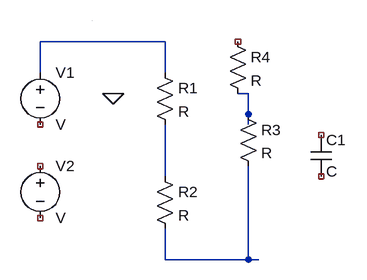
[diagram p0: schematic Draft1.asc]
Draft1.asc, the LTspice schematic file:
Version 4.1
SHEET 1 880 680
WIRE 112 32 -80 32
WIRE -80 80 -80 32
WIRE 112 80 112 32
WIRE 240 112 224 112
WIRE 240 144 240 112
WIRE 240 160 240 144
WIRE 112 240 112 160
WIRE 112 368 112 320
WIRE 240 368 240 224
WIRE 240 368 112 368
WIRE 256 368 240 368
WIRE 0 0 0 0
FLAG 32 112 0
SYMBOL voltage -80 64 R0
SYMATTR InstName V1
SYMBOL voltage -80 208 R0
SYMATTR InstName V2
SYMBOL res 96 64 R0
SYMATTR InstName R1
SYMBOL res 96 224 R0
SYMATTR InstName R2
SYMBOL res 224 128 R0
SYMATTR InstName R3
SYMBOL res 208 16 R0
SYMATTR InstName R4
SYMBOL cap 336 176 R0
SYMATTR InstName C1

The netlist it stands for:
* Draft1.asc
V1 N001 NC_01 V
V2 NC_02 NC_03 V
R1 N001 N003 R
R2 N003 N004 R
R3 N002 N004 R
R4 NC_04 N002 R
C1 NC_05 NC_06 C
.backanno
.end